# Altium schematic sheet Part29.SchDoc
size A
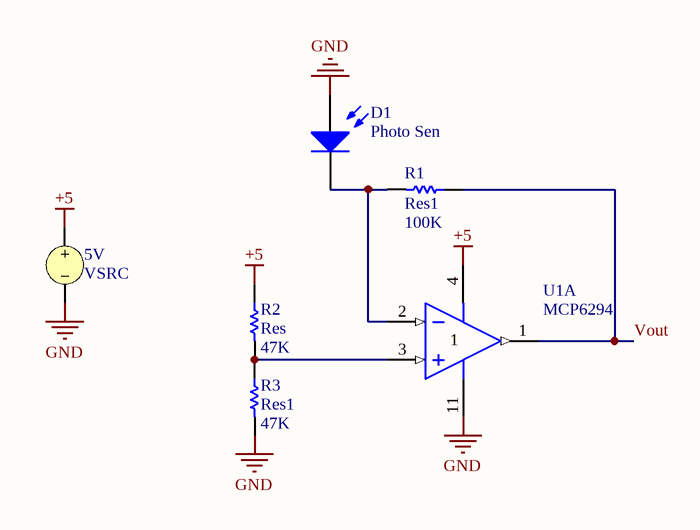
[diagram p0: Part29.SchDoc]

## Parts
5V  VSRC
D1  Photo Sen  [PIN2]
R1  Res1  value 100K  [AXIAL-0.3]
R2  Res  value 47K  [AXIAL-0.3]
R3  Res1  value 47K  [AXIAL-0.3]
U1  MCP6294  [DIP-14]  (part A of 4)

## Nets
+5: 5V.1 R2.1 U1.4(V+)
GND: 5V.2 D1.1(A) R3.2 U1.11(GND)
Vout: R1.1 U1.1(OUT)
NetD1_2: D1.2(K) R1.2 U1.2(IN-)
NetR2_2: R2.2 R3.1 U1.3(IN+)

## Library data of the parts
5V = VSRC: Voltage Source; Note: PCB Footprint - Not required; Value: +5; Published: 8-Jun-2000; LatestRevisionDate: 17-Jul-2002; LatestRevisionNote: Re-released for DXP Platform.; PackageReference: Not Applicable; Publisher: Altium Limited
D1 = Photo Sen: Photosensitive Diode; Manufacturer: Generic Components; Class: Optoelectronic; Published: 1999
R1-R3 = Res1: Resistor; Manufacturer: Generic Components; Class: Passive; Published: 08/06/2000; Publisher: Altium Hobart Technology Centre; SubClass: Resistor
U1 = LM324AJ: Low-Power Quad Operational Amplifier; Manufacturer: National Semiconductor; Published: 15/04/2002; Publisher: Altium Hobart Technology Centre; Class: Amplifier; SubClass: Operational Amplifier